# EAGLE schematic MAIN (EAGLE 7.6.0)
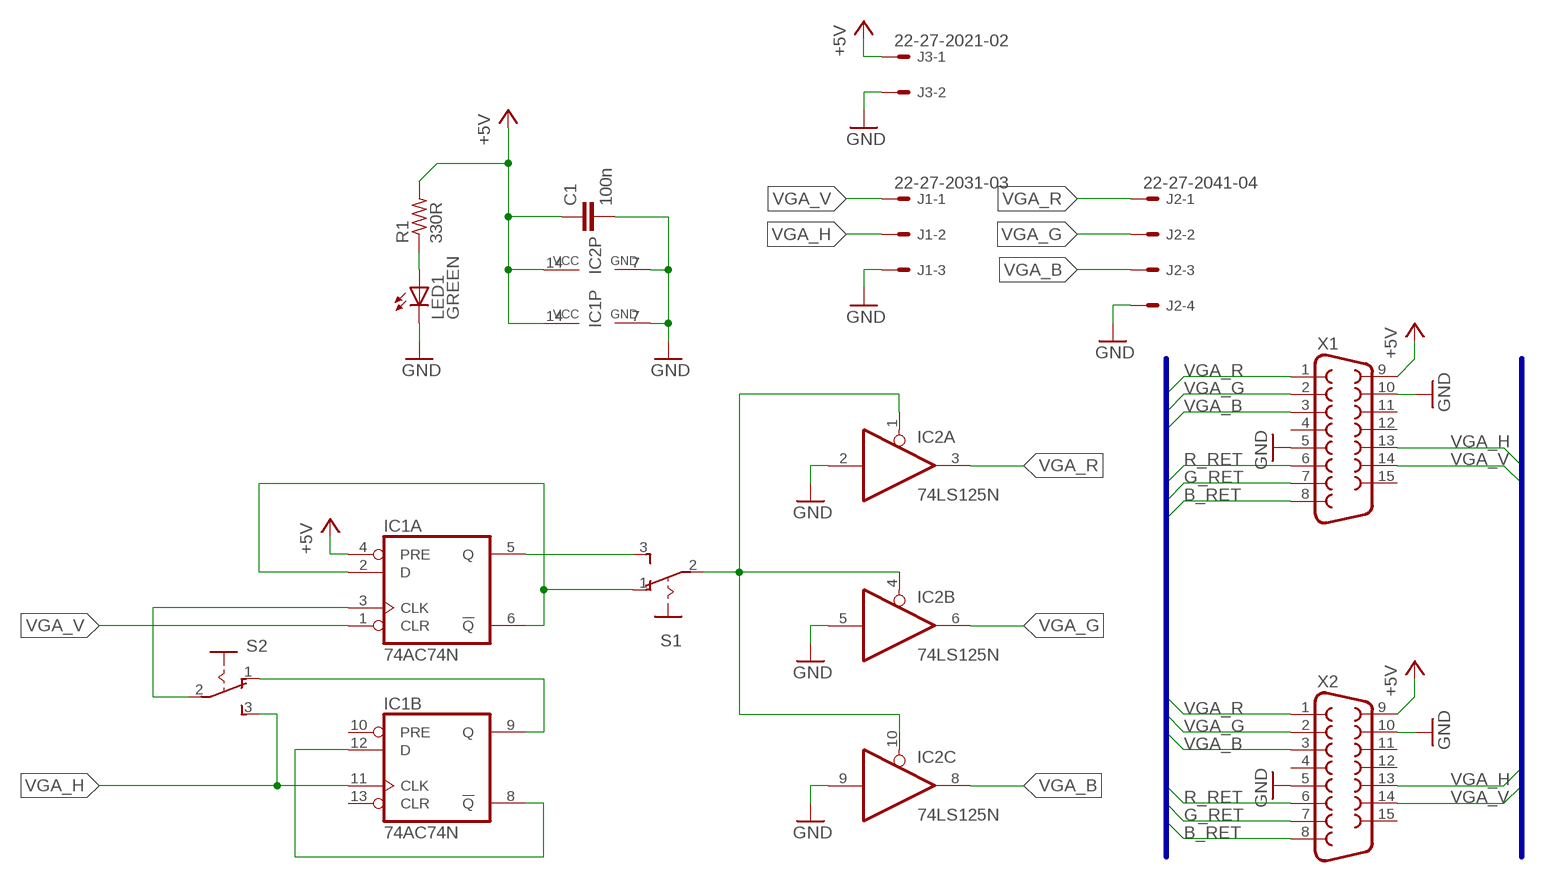
[diagram p0: schematic, sheet 1]

## Parts
C1  100n  C-EU075-032X103  [C075-032X103]
IC1  74AC74N  [DIL14]
IC2  74LS125N  [DIL14]
J1  22-27-2031-03  [6410-03]
J2  22-27-2041-04  [6410-04]
J3  22-27-2021-02  [6410-02]
LED1  GREEN  LED5MM  [LED5MM]
R1  330R  R-US_0204/7  [0204/7]
S1  255SB  [255SB]
S2  255SB  [255SB]
X1  F15HDH  [HDF15H]
X2  F15HDH  [HDF15H]

## Nets
+5V: C1.1 IC1.4(A:PRE) IC1.14(P:VCC) IC2.14(P:VCC) J3.1 R1.2 X1.9 X2.9
B_RET: X1.8 X2.8
G_RET: X1.7 X2.7
GND: C1.2 IC1.7(P:GND) IC2.2(A:I) IC2.5(B:I) IC2.7(P:GND) IC2.9(C:I) J1.3 J2.4 J3.2 LED1.K(C) X1.5 X1.10 X2.5 X2.10
N$1: IC1.8(B:!Q) IC1.12(B:D)
N$2: IC1.9(B:Q) S2.1(O)
N$3: IC1.3(A:CLK) S2.2(P)
N$4: IC1.2(A:D) IC1.6(A:!Q) S1.1(O)
N$5: IC1.5(A:Q) S1.3(S)
N$6: IC2.1(A:OE) IC2.4(B:OE) IC2.10(C:OE) S1.2(P)
N$9: LED1.A R1.1
R_RET: X1.6 X2.6
VGA_B: IC2.8(C:O) J2.3 X1.3 X2.3
VGA_G: IC2.6(B:O) J2.2 X1.2 X2.2
VGA_H: IC1.11(B:CLK) J1.2 S2.3(S) X1.13 X2.13
VGA_R: IC2.3(A:O) J2.1 X1.1 X2.1
VGA_V: IC1.1(A:CLR) J1.1 X1.14 X2.14
Unconnected: IC1.10(B:PRE) IC1.13(B:CLR) IC2.11(D:O) IC2.12(D:I) IC2.13(D:OE) X1.4 X1.11 X1.12 X1.15 X2.4 X2.11 X2.12 X2.15

## Buses
B$1
B$2

## Library data of the parts
C1 = rcl:C-EU: CAPACITOR, European symbol
IC1 = 74xx-eu:74*74: Dual D type positive edge triggered FLIP FLOP, preset and clear
IC2 = 74xx-eu:74*125: Quad bus BUFFER, 3-state
J1 = con-molex:22-?-03: CONNECTOR wire to board 2.54 mm (.1 inch) pitch header; OC_FARNELL: unknown; OC_NEWARK: unknown
J2 = con-molex:22-?-04: CONNECTOR wire to board 2.54 mm (.1 inch) pitch header; OC_FARNELL: unknown; OC_NEWARK: unknown
J3 = con-molex:22-?-02: CONNECTOR wire to board 2.54 mm (.1 inch) pitch header; OC_FARNELL: unknown; OC_NEWARK: unknown
LED1 = led:LED: LED OSRAM: - CHIPLED LG R971, LG N971, LY N971, LG Q971, LY Q971, LO R971, LY R971 LH N974, LH R974 LS Q976, LO Q976, LY Q976 LO Q996 - Hyper CHIPLED LW Q18S LB Q993, LB Q99A, LB R99A - SideLED LS A670, LO A670, LY A670, LG A670, LP A670 LB A673, LV A673, LT A673, LW A673 LH A674 LY A675 LS A676, LA A676, LO A676, LY A676, LW A676 LS A679, LY A679, LG A679 - Hyper Micro SIDELED® LS Y876, LA Y876, LO Y876, LY Y876 LT Y87S - SmartLED LW L88C, LW L88S LB L89C, LB L89S, LG L890 LS L89K, LO L89K, LY L89K LS L896, LA L896, LO L896, LY L896 - TOPLED LS T670, LO T670, LY T670, LG T670, LP T670 LSG T670, LSP T670, LSY T670, LOP T670, LYG T670 LG T671, LOG T671, LSG T671 LB T673, LV T673, LT T673, LW T673 LH T674 LS T676, LA T676, LO T676, LY T676, LB T676, LH T676, LSB T676, LW T676 LB T67C, LV T67C, LT T67C, LS T67K, LO T67K, LY T67K, LW E67C LS E67B, LA E67B, LO E67B, LY E67B, LB E67C, LV E67C, LT E67C LW T67C LS T679, LY T679, LG T679 LS T770, LO T770, LY T770, LG T770, LP T770 LB T773, LV T773, LT T773, LW T773 LH T774 LS E675, LA E675, LY E675, LS T675 LS T776, LA T776, LO T776, LY T776, LB T776 LHGB T686 LT T68C, LB T68C - Hyper Mini TOPLED® LB M676 - Mini TOPLED Santana® LG M470 LS M47K, LO M47K, LY M47K Source: http://www.osram.convergy.de LUXEON: - LUMILED® LXK2-PW12-R00, LXK2-PW12-S00, LXK2-PW14-U00, LXK2-PW14-V00 LXK2-PM12-R00, LXK2-PM12-S00, LXK2-PM14-U00 LXK2-PE12-Q00, LXK2-PE12-R00, LXK2-PE12-S00, LXK2-PE14-T00, LXK2-PE14-U00 LXK2-PB12-K00, LXK2-PB12-L00, LXK2-PB12-M00, LXK2-PB14-N00, LXK2-PB14-P00, LXK2-PB14-Q00 LXK2-PR12-L00, LXK2-PR12-M00, LXK2-PR14-Q00, LXK2-PR14-R00 LXK2-PD12-Q00, LXK2-PD12-R00, LXK2-PD12-S00 LXK2-PH12-R00, LXK2-PH12-S00 LXK2-PL12-P00, LXK2-PL12-Q00, LXK2-PL12-R00 Source: www.luxeon.com KINGBRIGHT: KA-3528ASYC Source: www.kingbright.com
R1 = rcl:R-US_: RESISTOR, American symbol
S1 S2 = switch:255SB: SLIDING SWITCH Distributor Buerklin, 11G810
X1 X2 = adafruit:F15: SUB-D HDH is also known as a 'right angle VGA' connector

## Net classes
0 default: width 0.305 mm